# EAGLE design basic_board (EAGLE 7.2.0)
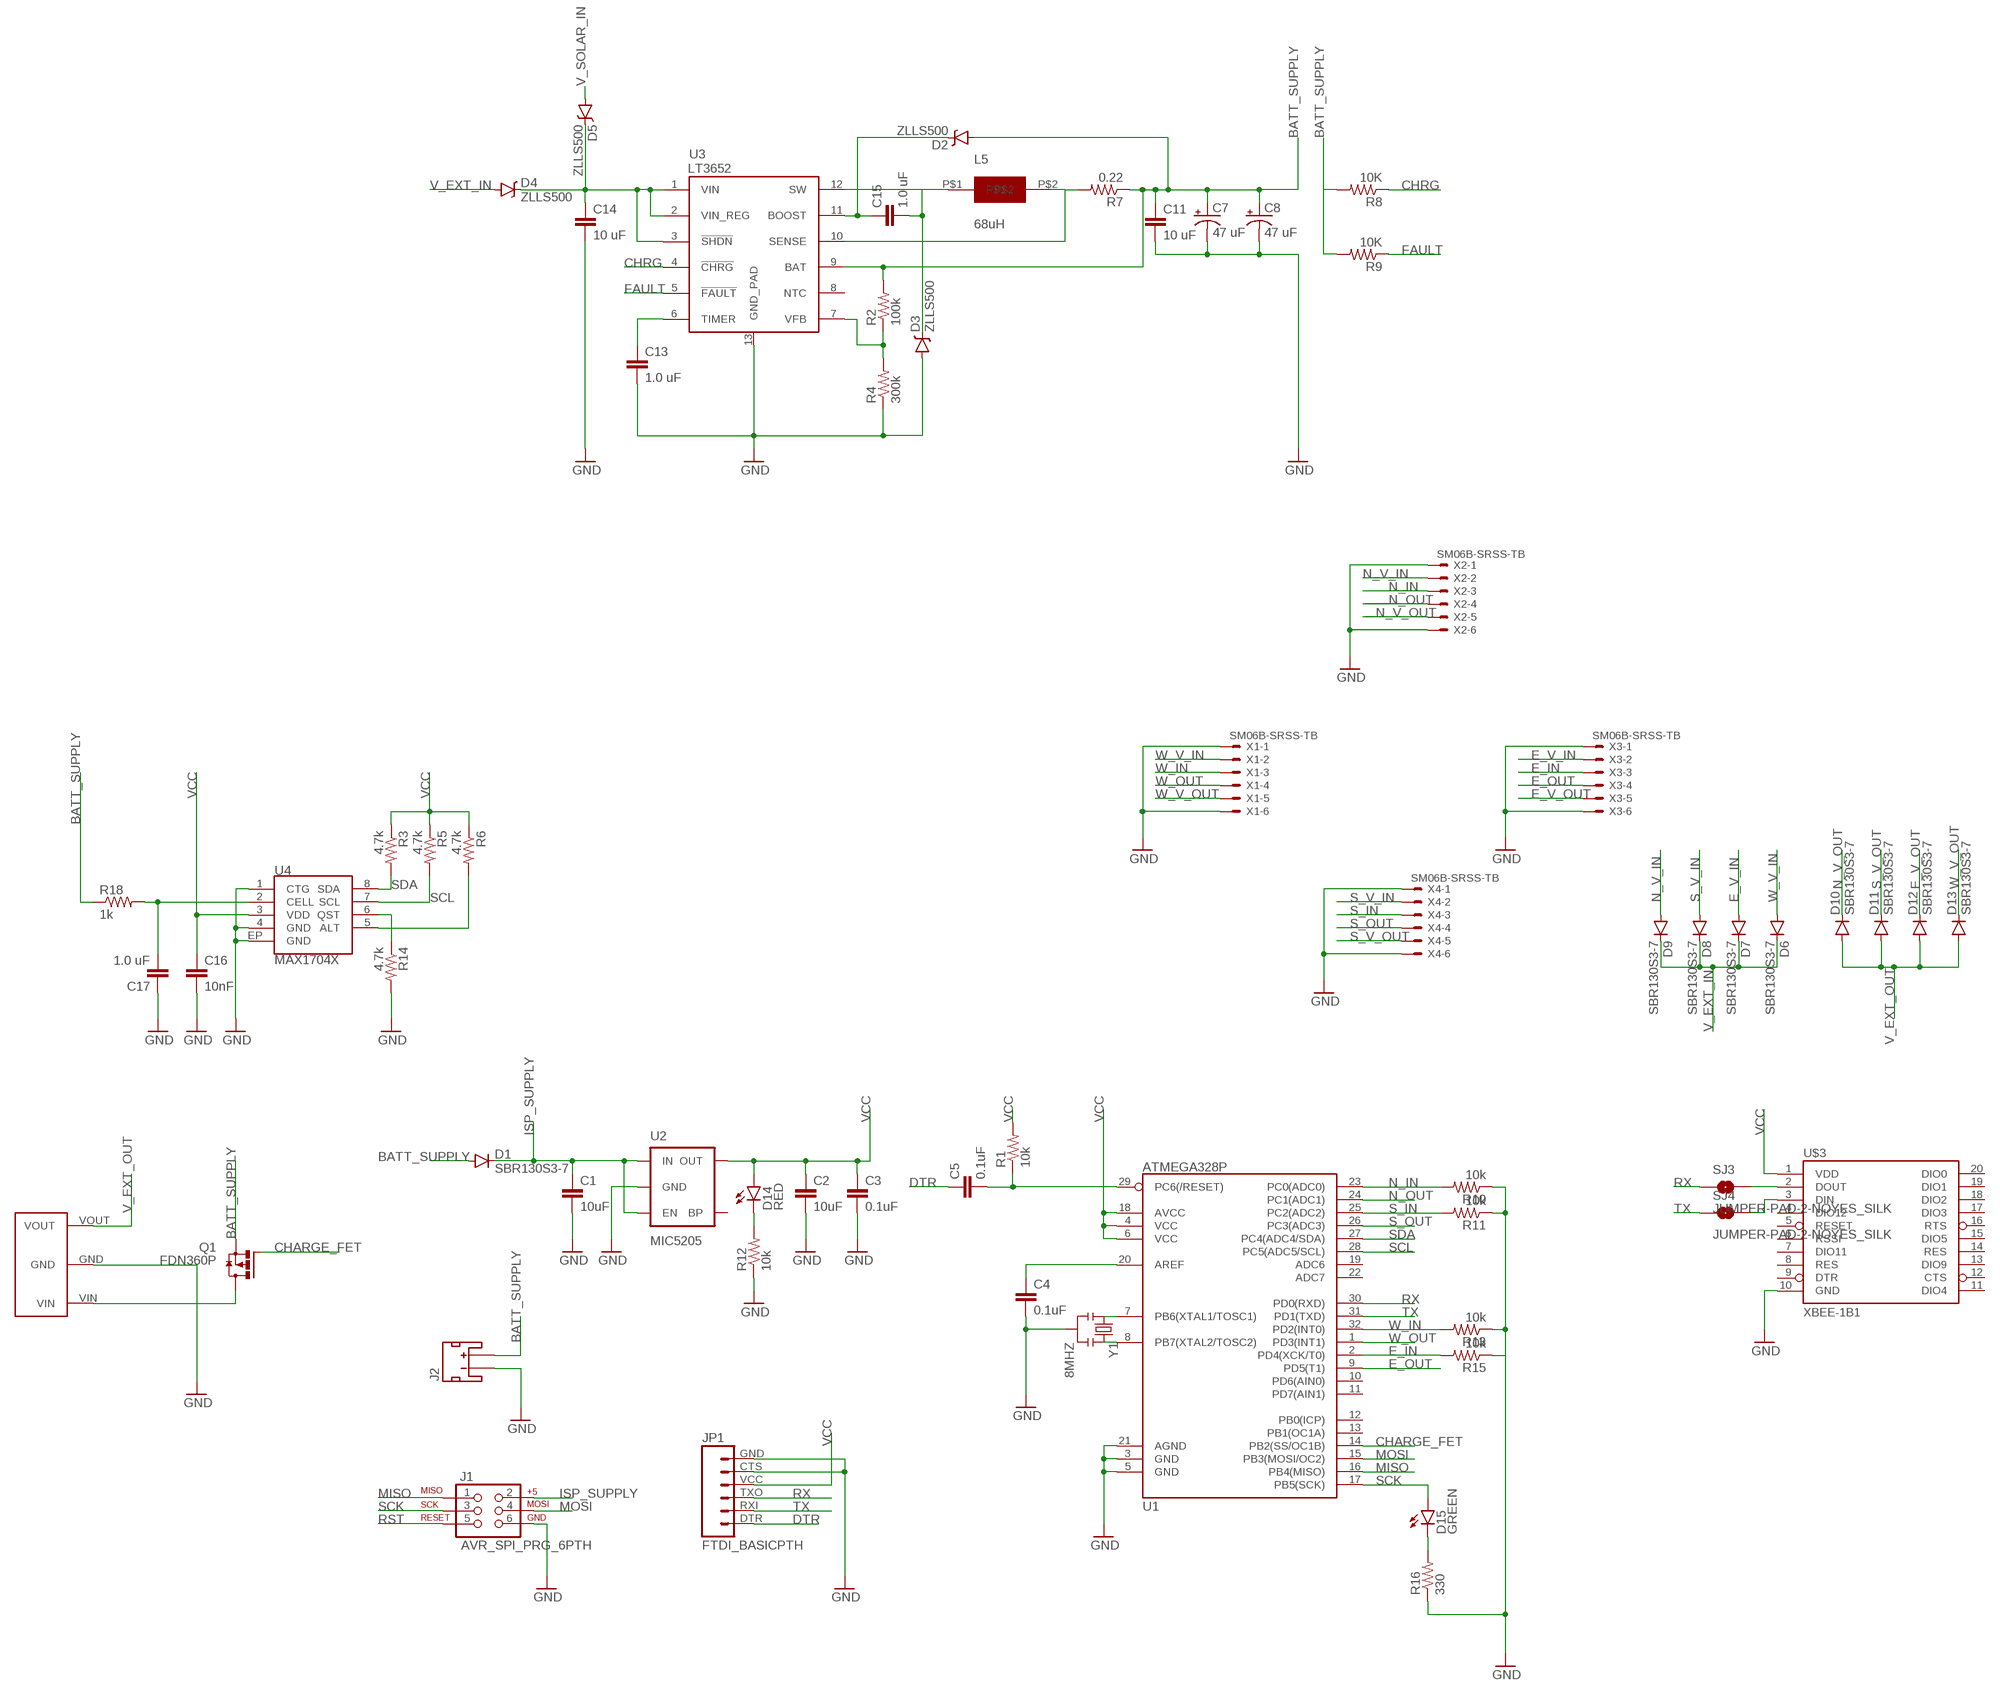
[diagram p0: schematic, sheet 1]

## Parts
C1  10uF  CAP1206  [1206]
C2  10uF  CAP1206  [1206]
C3  0.1uF  CAP1206  [1206]
C4  0.1uF  CAP0603-CAP  [0603-CAP]
C5  0.1uF  CAP0603-CAP  [0603-CAP]
C7  47 uF  CAP_POL1206  [EIA3216]
C8  47 uF  CAP_POL1206  [EIA3216]
C11  10 uF  10UF-6.3V-20%(1206)  [1206]
C13  1.0 uF  10UF-6.3V-20%(1206)  [1206]
C14  10 uF  10UF-6.3V-20%(1206)  [1206]
C15  1.0 uF  10UF-6.3V-20%(1206)  [1206]
C16  10nF  CAP0603-CAP  [0603-CAP]
C17  1.0 uF  CAP0603-CAP  [0603-CAP]
D1  SBR130S3-7  DIODESOD  [SOD-323]
D2  ZLLS500  ZLLS500ZLLS500  [SOT23]
D3  ZLLS500  ZLLS500ZLLS500  [SOT23]
D4  ZLLS500  ZLLS500ZLLS500  [SOT23]
D5  ZLLS500  ZLLS500ZLLS500  [SOT23]
D6  SBR130S3-7  DIODESOD  [SOD-323]
D7  SBR130S3-7  DIODESOD  [SOD-323]
D8  SBR130S3-7  DIODESOD  [SOD-323]
D9  SBR130S3-7  DIODESOD  [SOD-323]
D10  SBR130S3-7  DIODESOD  [SOD-323]
D11  SBR130S3-7  DIODESOD  [SOD-323]
D12  SBR130S3-7  DIODESOD  [SOD-323]
D13  SBR130S3-7  DIODESOD  [SOD-323]
D14  RED  LED-RED0603  [LED-0603]
D15  GREEN  LED-GREEN0603  [LED-0603]
J1  AVR_SPI_PRG_6PTH  [2X3]
J2  JST_2MM_MALE  [JST-2-SMD]
JP1  FTDI_BASICPTH  [FTDI_BASIC]
L5  68uH  MURATA_29L683CSMD1  [MURATA_29L68C]
Q1  FDN360P  [SUPER-SOT3]
R1  10k  RESISTOR0603-RES  [0603-RES]
R2  100k  RESISTOR1206  [1206]
R3  4.7k  RESISTOR0603-RES  [0603-RES]
R4  300k  RESISTOR1206  [1206]
R5  4.7k  RESISTOR0603-RES  [0603-RES]
R6  4.7k  RESISTOR0603-RES  [0603-RES]
R7  0.22  RESISTOR1206  [1206]
R8  10K  RESISTOR1206  [1206]
R9  10K  RESISTOR1206  [1206]
R10  10k  RESISTOR0603-RES  [0603-RES]
R11  10k  RESISTOR0603-RES  [0603-RES]
R12  10k  RESISTOR1206  [1206]
R13  10k  RESISTOR0603-RES  [0603-RES]
R14  4.7k  RESISTOR0603-RES  [0603-RES]
R15  10k  RESISTOR0603-RES  [0603-RES]
R16  330  RESISTOR1206  [1206]
R18  1k  RESISTOR0603-RES  [0603-RES]
SJ3  JUMPER-PAD-2-NOYES_SILK  [PAD-JUMPER-2-NO_YES_SILK]
SJ4  JUMPER-PAD-2-NOYES_SILK  [PAD-JUMPER-2-NO_YES_SILK]
U1  ATMEGA328P  ATMEGA328_SMT  [TQFP32-08]
U2  MIC5205  MIC52053.3V  [SOT23-5]
U3  LT3652  [MSOP-12_GND]
U4  MAX1704X  [TDFN-8]
U$1  POLOLU791BOOSTPOLOLU  [POLOLU791_BOOST]
U$3  XBEE-1B1  [XBEE-1]
X1  SM06B-SRSS-TB  [SM06B-SRSS-TB]
X2  SM06B-SRSS-TB  [SM06B-SRSS-TB]
X3  SM06B-SRSS-TB  [SM06B-SRSS-TB]
X4  SM06B-SRSS-TB  [SM06B-SRSS-TB]
Y1  8MHZ  RESONATOR8MHZ  [RESONATOR-SMD]

## Nets
BATT_SUPPLY: C7.A(+) C8.A(+) C11.1 D1.A D2.1(A) J2.2(+) Q1.2(S) R2.2 R7.1 R8.2 R9.2 R18.1 U3.9(BAT)
CHARGE_FET: Q1.1(G) U1.14(PB2(SS/OC1B))
CHRG: R8.1 U3.4(!CHRG)
DTR: C5.1 JP1.DTR
E_IN: R15.2 U1.2(PD4(XCK/T0)) X3.3
E_OUT: U1.9(PD5(T1)) X3.4
E_V_IN: D7.A X3.2
E_V_OUT: D12.C X3.5
FAULT: R9.1 U3.5(!FAULT)
GND: C1.2 C2.2 C3.2 C4.2 C7.C(-) C8.C(-) C11.2 C13.2 C14.2 C16.2 C17.1 D3.1(A) J1.6 J2.1(-) JP1.CTS JP1.GND R4.1 R10.1 R11.1 R12.1 R13.1 R14.2 R15.1 R16.1 U1.3(GND) U1.5(GND) U1.21(AGND) U2.2(GND) U3.13(GND_PAD) U4.1(CTG) U4.4(GND) U4.EP(GND) U$1.GND U$3.10(GND) X1.1 X1.6 X2.1 X2.6 X3.1 X3.6 X4.1 X4.6 Y1.2
ISP_SUPPLY: C1.1 D1.C J1.2 U2.1(IN) U2.3(EN)
MISO: J1.1 U1.16(PB4(MISO))
MOSI: J1.4 U1.15(PB3(MOSI/OC2))
N$1: C13.1 U3.6(TIMER)
N$2: L5.P$2 R7.2 U3.10(SENSE)
N$4: C4.1 U1.20(AREF)
N$6: R6.2 U4.5(ALT)
N$8: R2.1 R4.2 U3.7(VFB)
N$10: C15.1 D2.3(C) U3.11(BOOST)
N$11: C15.2 D3.3(C) L5.P$1 U3.12(SW)
N$14: R14.1 U4.6(QST)
N$19: Q1.3(D) U$1.VIN
N$20: U1.7(PB6(XTAL1/TOSC1)) Y1.1
N$21: U1.8(PB7(XTAL2/TOSC2)) Y1.3
N$22: C17.2 R18.2 U4.2(CELL)
N$23: SJ3.2 U$3.2(DOUT)
N$24: SJ4.2 U$3.3(DIN)
N$28: D14.C R12.2
N$30: D15.C R16.2
N$31: C14.1 D4.3(C) D5.3(C) U3.1(VIN) U3.2(VIN_REG) U3.3(!SHDN)
N_IN: R10.2 U1.23(PC0(ADC0)) X2.3
N_OUT: U1.24(PC1(ADC1)) X2.4
N_V_IN: D9.A X2.2
N_V_OUT: D10.C X2.5
RST: C5.2 J1.5 R1.1 U1.29(PC6(/RESET))
RX: JP1.TXO SJ3.1 U1.30(PD0(RXD))
S_IN: R11.2 U1.25(PC2(ADC2)) X4.3
S_OUT: U1.26(PC3(ADC3)) X4.4
S_V_IN: D8.A X4.2
S_V_OUT: D11.C X4.5
SCK: D15.A J1.3 U1.17(PB5(SCK))
SCL: R5.2 U1.28(PC5(ADC5/SCL)) U4.7(SCL)
SDA: R3.2 U1.27(PC4(ADC4/SDA)) U4.8(SDA)
TX: JP1.RXI SJ4.1 U1.31(PD1(TXD))
V_EXT_IN: D4.1(A) D6.C D7.C D8.C D9.C
V_EXT_OUT: D10.A D11.A D12.A D13.A U$1.VOUT
V_SOLAR_IN: D5.1(A)
VCC: C2.1 C3.1 C16.1 D14.A JP1.VCC R1.2 R3.1 R5.1 R6.1 U1.4(VCC) U1.6(VCC) U1.18(AVCC) U2.5(OUT) U4.3(VDD) U$3.1(VDD)
W_IN: R13.2 U1.32(PD2(INT0)) X1.3
W_OUT: U1.1(PD3(INT1)) X1.4
W_V_IN: D6.A X1.2
W_V_OUT: D13.C X1.5
Unconnected: J2.NC1(PAD1) J2.NC2(PAD2) U1.10(PD6(AIN0)) U1.11(PD7(AIN1)) U1.12(PB0(ICP)) U1.13(PB1(OC1A)) U1.19(ADC6) U1.22(ADC7) U2.4(BP) U3.8(NTC) U$3.4(DIO12) U$3.5(RESET) U$3.6(RSSI) U$3.7(DIO11) U$3.8(RES) U$3.9(DTR) U$3.11(DIO4) U$3.12(CTS) U$3.13(DIO9) U$3.14(RES) U$3.15(DIO5) U$3.16(RTS) U$3.17(DIO3) U$3.18(DIO2) U$3.19(DIO1) U$3.20(DIO0)

## Library data of the parts
C1-C3 = SparkFun-Capacitors:CAP: Capacitor Standard 0603 ceramic capacitor, and 0.1" leaded capacitor.
C4 C5 C16 C17 = SparkFun-Passives:CAP: Capacitor Standard 0603 ceramic capacitor, and 0.1" leaded capacitor.
C7 C8 = SparkFun-Capacitors:CAP_POL: Capacitor Polarized These are standard SMD and PTH capacitors. Normally 10uF, 47uF, and 100uF in electrolytic and tantalum varieties. Always verify the external diameter of the through hole cap, it varies with capacity, voltage, and manufacturer. The EIA devices should be standard.
C11 C13-C15 = SparkFun-Capacitors:10UF-6.3V-20%(1206): CAP-10057 Ceramic; PROD_ID: CAP-10057; VALUE: 10uF
D1 D6-D13 = SparkFun-DiscreteSemi:DIODE: Diode These are standard reverse protection diodes and small signal diodes. SMA package can handle up to about 1A. SOD-323 can handle about 200mA. What the SOD-323 package when ordering, there are some mfgs out there that are 5-pin packages.; PROD_ID: DIO-09646
D2-D5 = SparkFun-DiscreteSemi:ZLLS500: 700mA 40V SOT-23 Schottky; PROD_ID: DIO-08411
D14 = SparkFun-LED:LED-RED: Assorted Red LEDs LilyPad 1206- DIO-09912 1206- DIO-00809 0603- DIO-00819; PROD_ID: DIO-00819
D15 = SparkFun-LED:LED-GREEN: Various green LEDs Green LEDs used in SFE Production 0603- DIO-00821 LARGE- DIO-00862 LILYPAD- DIO-09910; PROD_ID: DIO-00821
J1 = SparkFun-Connectors:AVR_SPI_PRG_6: AVR ISP 6 Pin This is the reduced ISP connector for AVR programming. Common on Arduino. This footprint will take up less PCB space and can be used with a 10-pin to 6-pin adapter such as SKU: BOB-08508 **Special note about "TEST_POINT" package. The stop mask is on the top side, so if you want your programming test points to be on the bottom of your board, make sure to place this package on the bottom side of the board. This also ensure that the orientation to program from the bottom side will be correct.
J2 = SparkFun-Connectors:JST_2MM_MALE: Mates to single-cell LiPo batteries. CONN-08352; PROD_ID: CONN-08352
JP1 = SparkFun-Connectors:FTDI_BASIC: FTDI Basic header with labels
L5 = Local_RUBICS:MURATA_29L683C
Q1 = transistor-power:FDN360P: Single P-Channel, PowerTrench (R) MOSFET Source: http://www.fairchildsemi.com/ds/FD/FDN360P.pdf
R1 R3 R5 R6 R10 R11 R13-R15 R18 = SparkFun-Passives:RESISTOR: Resistor Basic schematic elements and footprints for 0603, 1206, and PTH resistors.
R2 R4 R7-R9 R12 R16 = SparkFun-Resistors:RESISTOR: Resistor Basic schematic elements and footprints for 0603, 1206, and PTH resistors.
SJ3 SJ4 = SparkFun-Passives:JUMPER-PAD-2-NO
U1 = SparkFun-DigitalIC:ATMEGA328_SMT: 32-Pin Atmega328 part Commonly used on Arduino compatible boards Available in QFP and QFN packages TQFP is IC-09069 QFN is non-stock; PROD_ID: IC-09069
U2 = SparkFun-PowerIC:MIC5205: MIC5205 150mA vreg 3.3V - VREG-00822 5V - VREG-00823; PROD_ID: VREG-00822
U3 = SparkFun-PowerIC:LT3652: LT3652 MPPT Solar Charge Controller 5V-32V smart charger for batteries up to 14.4V
U4 = SparkFun-PowerIC:MAX1704X: MAX17043/MAX17044: Battery Fuel Guage (43 is 1cell, 44 is 2cell)
U$1 = Local_RUBICS:POLOLU791BOOST
U$3 = SparkFun-RF:XBEE-1: Xbee module footprints SMT header is CONN-09042.
X1-X4 = con-jst2:?M06B-SRSS-TB: Disconnectable Crimp style connector, 1.0mm pitch 6 contacts
Y1 = SparkFun-FreqCtrl:RESONATOR: Resonator Small SMD resonator. Used, eg, on the Arduino Pro/ Pro Mini boards. 8MHz- XTAL-08895 16MHz- XTAL-08900; PROD_ID: XTAL-08895

## Board
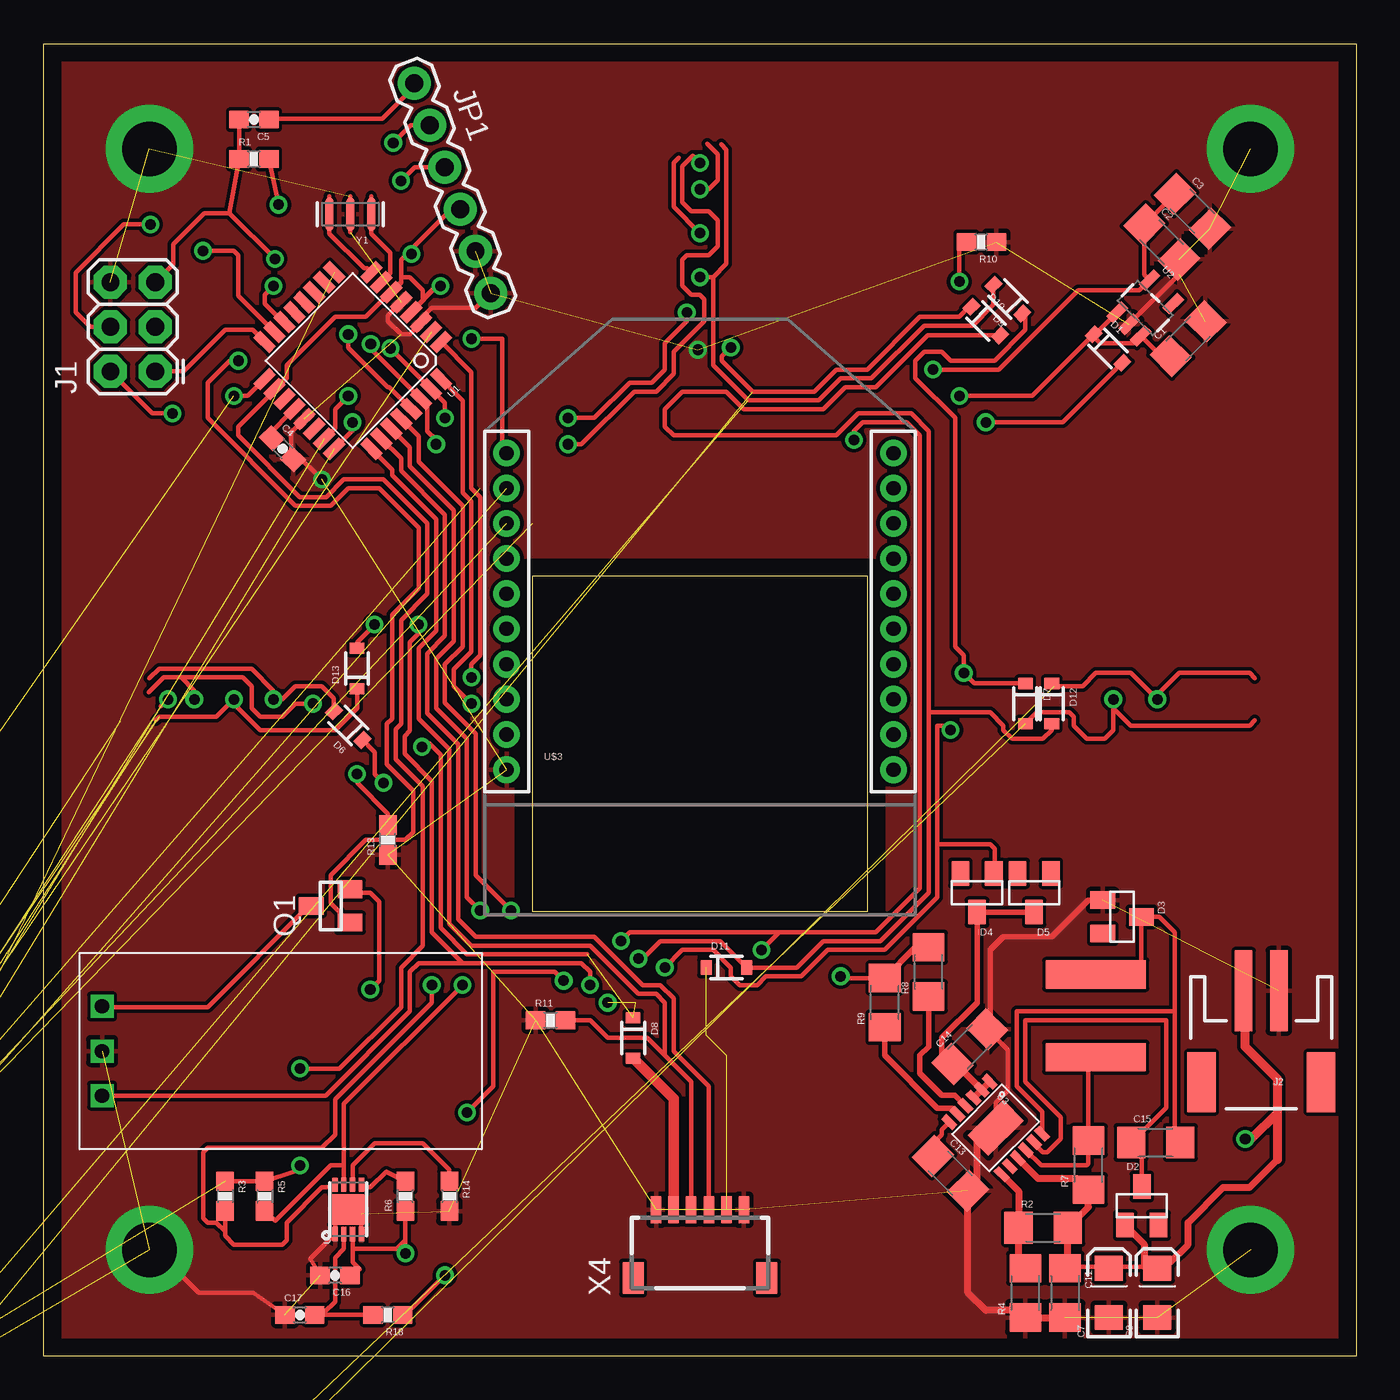
[diagram p1: board, top side]
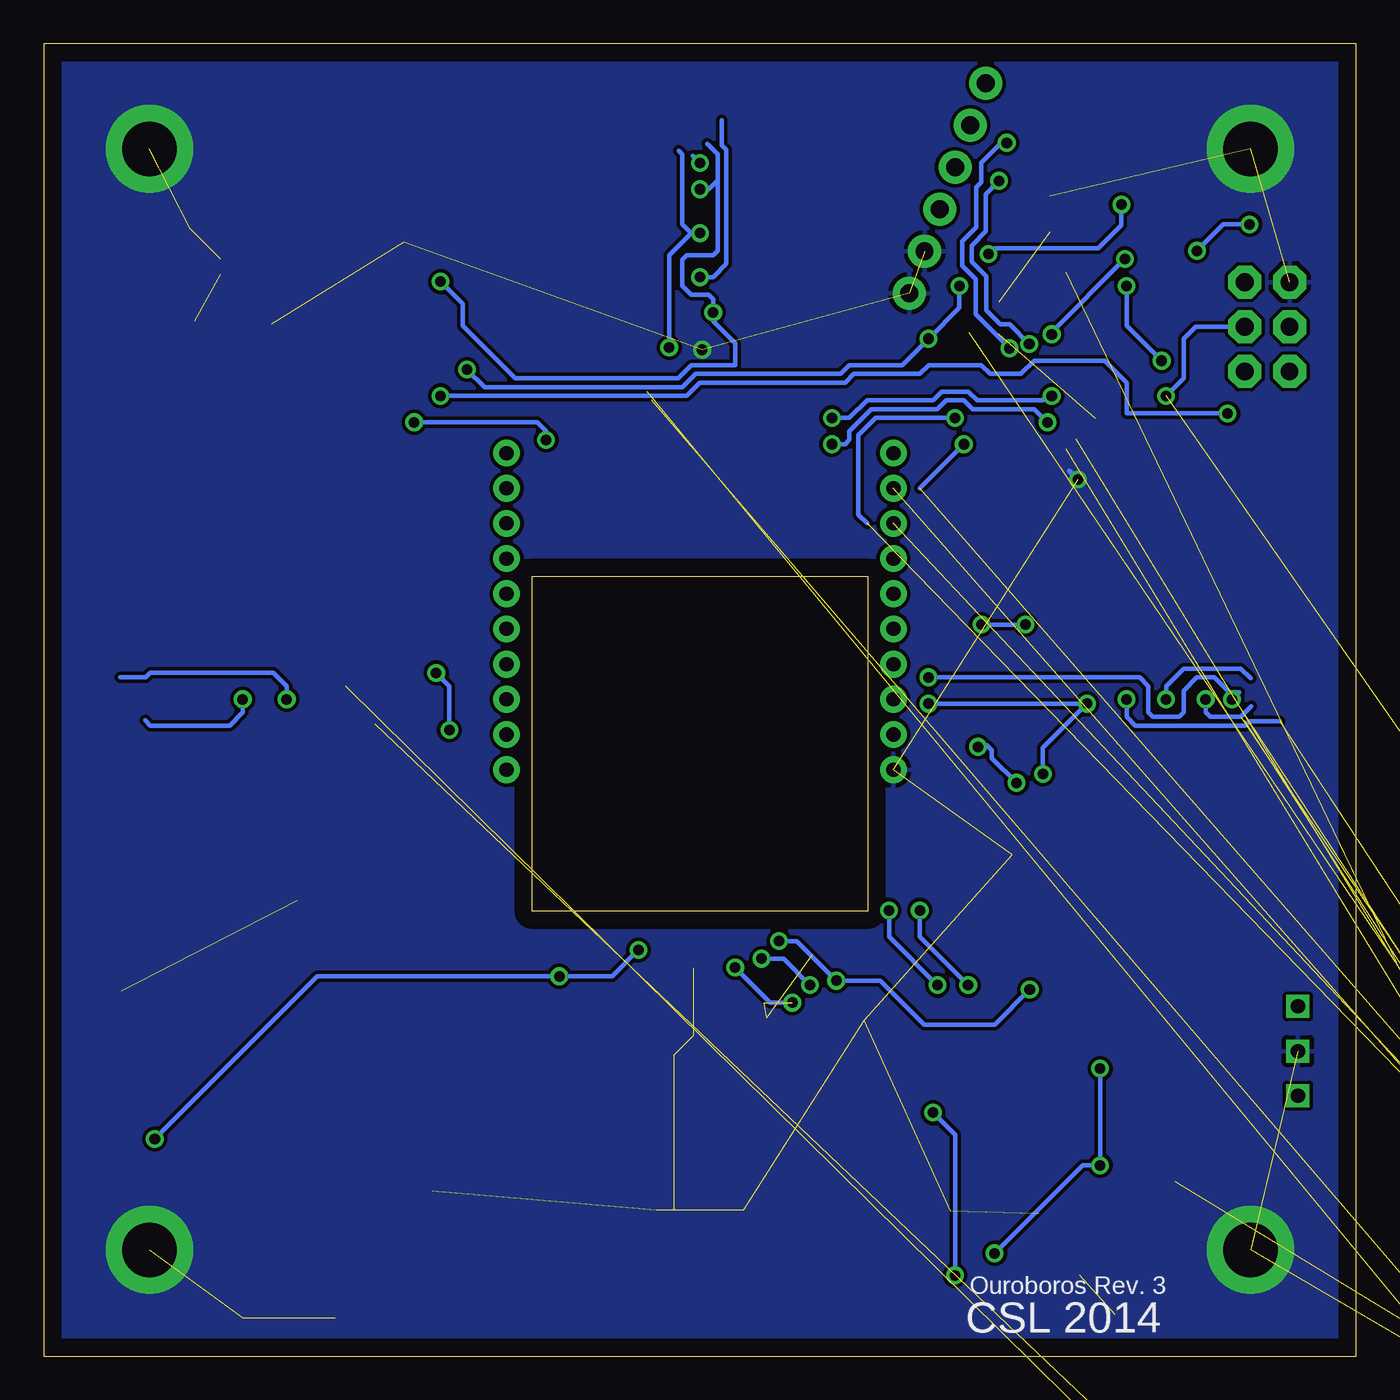
[diagram p2: board, bottom side, seen from below]

Size 74.6 x 74.6 mm. Coordinates in mm from the lower left corner, seen from the top.
Outline: 27.78,25.27 46.82,25.27 46.82,44.33 27.78,44.33 27.78,25.27
Outline: 0,74.6 74.6,74.6 74.6,0 0,0 0,74.6
Copper layers (1*16): Top 0.035mm / dielectric 1.5mm / Bottom 0.035mm
Design rules "default *": minimum track width 8mil, minimum drill 24mil, track to track 8mil, track to pad 8mil, pad to pad 8mil, via to via 8mil, smd to smd 8mil, copper to edge 40mil, drill to drill 8mil, minimum pad ring 10mil, minimum via ring 8mil, stop-mask expansion 4mil, vias tented up to drill 25mil, thermal gap 10mil
tRestrict: area 27.8,25.1 to 46.8,44.3
bRestrict: area 27.8,25.1 to 46.8,44.3

### Footprints (pad centres in the part's own frame; a part is rotated, then mirrored left to right if it is on the bottom)
1206 = smd 1.6 x 1.8: 1 -1.4,0; 2 1.4,0
0603-CAP = smd 1.1 x 1: 1 -0.85,0; 2 0.85,0
EIA3216 = smd 1.4 x 1.6: A 1.4,0; C -1.4,0
SOD-323 = smd 0.63 x 0.83: A 1.15,0; C -1.15,0
SOT23 = smd 1 x 1.4: 1 -0.95,-1.1; 2 0.95,-1.1; 3 0,1.1
LED-0603 = smd 1 x 1: A 0,-0.877; C 0,0.877
2X3 = drill 1.016 pad 1.88 octagon: 1 0,0; 2 0,2.54; 3 2.54,0; 4 2.54,2.54; 5 5.08,0; 6 5.08,2.54
JST-2-SMD = smd 1 x 4.6: 1 -1,-3.7; 2 1,-3.7 | smd 1.6 x 3.4: NC1 -3.4,1.5; NC2 3.4,1.5
FTDI_BASIC = drill 1.016 pad 1.88: CTS 10.16,0; DTR 0,0; GND 12.7,0; RXI 2.54,0; TXO 5.08,0; VCC 7.62,0
MURATA_29L68C = smd 1.6 x 5.7: P$1 -2.35,0; P$2 2.35,0
SUPER-SOT3 = smd 1 x 1.4: 1 -0.95,-1.1; 2 0.95,-1.1; 3 0,1.1
0603-RES = smd 1.1 x 1: 1 -0.85,0; 2 0.85,0
PAD-JUMPER-2-NO_YES_SILK = smd 0.635 x 1.27: 1 -0.45,0; 2 0.45,0
TQFP32-08 = smd 1.27 x 0.559: 1 -4.293,2.8; 2 -4.293,2; 3 -4.293,1.2; 4 -4.293,0.4; 5 -4.293,-0.4; 6 -4.293,-1.2; 7 -4.293,-2; 8 -4.293,-2.8; 17 4.293,-2.8; 18 4.293,-2; 19 4.293,-1.2; 20 4.293,-0.4; 21 4.293,0.4; 22 4.293,1.2; 23 4.293,2; 24 4.293,2.8 | smd 0.559 x 1.27: 9 -2.8,-4.293; 10 -2,-4.293; 11 -1.2,-4.293; 12 -0.4,-4.293; 13 0.4,-4.293; 14 1.2,-4.293; 15 2,-4.293; 16 2.8,-4.293; 25 2.8,4.293; 26 2,4.293; 27 1.2,4.293; 28 0.4,4.293; 29 -0.4,4.293; 30 -1.2,4.293; 31 -2,4.293; 32 -2.8,4.293
SOT23-5 = smd 0.55 x 1.2: 1 -0.95,-1.3; 2 0,-1.3; 3 0.95,-1.3; 4 0.95,1.3; 5 -0.95,1.3
MSOP-12_GND = smd 0.889 x 0.42: 1 -2.1,1.625; 2 -2.1,0.975; 3 -2.1,0.325; 4 -2.1,-0.325; 5 -2.1,-0.975; 6 -2.1,-1.625; 7 2.1,-1.625; 8 2.1,-0.975; 9 2.1,-0.325; 10 2.1,0.325; 11 2.1,0.975; 12 2.1,1.625 | smd 1.651 x 2.845: 13 0,0
TDFN-8 = smd 0.8 x 0.3: 1 -1.4,0.75; 2 -1.4,0.25; 3 -1.4,-0.25; 4 -1.4,-0.75; 5 1.4,-0.75; 6 1.4,-0.25; 7 1.4,0.25; 8 1.4,0.75 | smd 1.73 x 1.88: EP 0,0
POLOLU791_BOOST = drill 0.8 square: GND 0,0; VIN 2.54,0; VOUT -2.54,0
XBEE-1 = drill 0.8 pad 1.524: 1 -11,20; 2 -11,18; 3 -11,16; 4 -11,14; 5 -11,12; 6 -11,10; 7 -11,8; 8 -11,6; 9 -11,4; 10 -11,2; 11 11,2; 12 11,4; 13 11,6; 14 11,8; 15 11,10; 16 11,12; 17 11,14; 18 11,16; 19 11,18; 20 11,20
SM06B-SRSS-TB = smd 0.6 x 1.55: 1 -2.5,2.975; 2 -1.5,2.975; 3 -0.5,2.975; 4 0.5,2.975; 5 1.5,2.975; 6 2.5,2.975 | smd 1.2 x 1.8: FIT@1 -3.8,-0.9; FIT@2 3.8,-0.9
RESONATOR-SMD = smd 0.45 x 1.905: 1 -1.2,0; 2 0,0; 3 1.2,0

### Placement (x,y rotation side)
C1  65.05,57.84 45 top
C2  63.55,63.34 315 top
C3  65.3,65.09 315 top
C4  13.56,51.59 315 top
C5  11.94,70.3 180 top
C7  60.55,3.59 90 top
C8  63.3,3.59 90 top
C11  58.05,3.59 270 top
C13  51.54,10.39 315 top
C14  52.64,17.59 45 top
C15  63.21,12.14 0 top
C16  16.55,4.59 180 top
C17  14.55,2.34 0 top
D1  60.5,57.28 315 top
D2  62.42,8.54 0 top
D3  61.3,24.97 270 top
D4  53.05,26.34 180 top
D5  56.3,26.34 180 top
D6  17.3,35.84 135 top
D7  55.8,37.09 270 top
D8  33.5,18.09 270 top
D9  54.8,60.09 135 top
D10  53.55,58.84 315 top
D11  38.8,22.09 0 top
D12  57.3,37.09 270 top
D13  17.8,39.09 90 top
D14  -37.9,-18.56 0 top  (outside the outline)
D15  -40.8,-18.56 0 top  (outside the outline)
J1  6.32,55.98 90 top
J2  69.21,17.07 180 top
JP1  21.06,72.37 290 top
L5  59.8,19.34 270 top
Q1  16.3,25.59 90 top
R1  11.94,68.06 0 top
R2  56.81,7.29 0 top
R3  10.3,9.09 270 top
R4  55.8,3.59 90 top
R5  12.55,9.09 270 top
R6  20.55,9.09 90 top
R7  59.39,10.85 90 top
R8  50.3,21.84 90 top
R9  47.8,20.09 90 top
R10  53.3,63.34 180 top
R11  28.8,19.09 0 top
R12  -33.7,-18.06 0 top  (outside the outline)
R13  19.55,29.34 90 top
R14  23.05,9.09 270 top
R15  -27.9,-14.26 0 top  (outside the outline)
R16  -39.5,-21.86 0 top  (outside the outline)
R18  19.55,2.34 180 top
SJ3  -43.5,-29.56 0 top  (outside the outline)
SJ4  -46.4,-29.56 0 top  (outside the outline)
U1  17.56,56.6 225 top
U2  62.61,59.59 315 top
U3  54.11,12.97 315 top
U4  17.3,8.34 90 top
U$1  3.3,17.34 90 top
U$3  37.3,31.34 0 top
X1  -35.2,-29.36 0 top  (outside the outline)
X2  -41,-44.86 0 top  (outside the outline)
X3  -41,-60.36 0 top  (outside the outline)
X4  37.3,5.34 0 top
Y1  17.42,64.92 180 top

### Tracks (layer width: path | path; a pad name or v marks a point on that pad's centre or on a via)
BATT_SUPPLY  (via drill 0.6)
  Top 0.25: R18.1 20.95,2.74 v22.8,4.59 | v24.05,13.84 25.55,15.34 25.55,21.84 29.05,21.84 v29.55,21.34 | v32.8,23.59 33.3,24.09 41.8,24.09 | 41.8,24.09 47.3,24.09 49.8,26.59 49.8,52.34 49.05,53.09 46.55,53.09 46.05,52.59 v46.05,52.09 | 41.8,24.09 v40.8,23.09 | Q1.2 17.6,26.34 18.55,26.34 19.05,25.84 19.05,21.34 v18.55,20.84 | R9.2 45.4,21.49 v45.3,21.59 | v68.3,12.34 68.64,12.34 | v53.55,53.09 57.94,53.09 D1.A | C8.A 62.9,4.99 62.8,5.09 | 62.8,5.09 62.67,5.21 62.55,5.34 62.55,6.34 61.47,7.42 D2.1 | 62.55,5.09 60.65,5.09 C7.A | 62.8,5.09 58.15,5.09 C11.1
  Top 0.3: R9.2 49.55,23.24 R8.2
  Top 0.4: C11.1 58.21,5.15 R2.2 59.39,8.47 R7.1 58.75,10.09 56.53,10.09 U3.9 | D2.1 62.55,6.36 62.55,6.34 62.55,5.09 62.67,5.21 62.8,5.34 64.05,5.34 65.05,6.34 65.05,7.59 67.05,9.59 68.55,9.59 70.14,11.18
  Top 0.5: 70.14,11.18 70.14,13.84 | 70.14,13.84 70.14,15.75 68.3,17.59 68.3,20.68 J2.2 | 68.64,12.34 70.14,13.84
  Bottom 0.25: v22.8,4.59 22.8,12.59 v24.05,13.84 | v40.8,23.09 42.3,21.59 v45.3,21.59 59.05,21.59 v68.3,12.34 | v46.05,52.09 46.05,52.59 46.55,53.09 v53.55,53.09 | v32.8,23.59 31.8,23.59 v29.55,21.34 27.05,21.34 24.55,18.84 20.55,18.84 v18.55,20.84
CHARGE_FET  (via drill 0.6)
  Top 0.25: Q1.1 16.3,25.74 16.3,27.34 18.3,29.34 20.55,29.34 21,29.79 21,32.14 19.5,33.64 19.5,35.94 19.8,36.24 19.8,42.14 21.3,43.64 21.3,47.09 19.05,49.34 17.3,49.34 16.3,48.34 14.3,48.34 9.3,53.34 9.3,55.34 10.55,56.59 v11.05,56.59 | v13.05,60.84 12.55,60.34 12.55,59.84 13.6,58.79 U1.14
  Bottom 0.25: v11.05,56.59 13.05,58.59 v13.05,60.84
CHRG
  Top 0.3: U3.4 51.78,14.84 51.05,14.84 49.8,16.09 49.8,17.09 50.3,17.59 R8.1
DTR
  Top 0.25: JP1.DTR 21.06,72.18 19.22,70.34 13.38,70.34 C5.1
E_IN  (2 unrouted)
E_OUT  (1 unrouted)
E_V_IN  (via drill 0.6)  (1 unrouted)
  Top 0.25: 68.85,36.14 68.55,35.84 61.8,35.84 60.8,36.84 | 60.8,36.84 v60.8,37.34 | 60.8,36.84 60.8,35.59 60.3,35.09 59.3,35.09 58.55,35.84 58.55,36.34 58.3,36.59 56.45,36.59 D7.A
  Bottom 0.25: v60.8,37.34 60.8,38.09 61.55,38.84 68.55,38.84 68.8,38.59 70.25,38.59
E_V_OUT  (via drill 0.6)  (1 unrouted)
  Top 0.25: v63.3,37.34 63.3,37.59 | 63.3,37.59 64.55,38.84 68.55,38.84 68.85,38.54 | 63.3,37.59 63.05,37.59 61.8,38.84 59.8,38.84 59.05,38.09 57.45,38.09 D12.C
  Bottom 0.25: 68.85,36.14 68.55,35.84 64.05,35.84 63.3,36.59 v63.3,37.34
FAULT
  Top 0.3: U3.5 51.61,14.09 50.8,14.09 47.8,17.09 R9.1
GND  (via drill 0.6, 3.1 pad 5)  (34 unrouted)
  Top 0.25: C16.2 15.15,5.54 U4.1 16.55,7.84 17.05,8.34 U4.EP 17.8,8.34 18.05,8.09 U4.4 | C17.1 11.9,3.59 8.8,3.59 6.35,6.04 v6,6.04 | JP1.GND 24.56,59.59 22.05,59.59 21.44,58.98 U1.3 21.44,58.73 20.8,58.09 20.3,58.09 19.55,58.84 19.55,59.16 U1.5 | 53.05,12.34 53.05,12.41 U3.13 54.11,14.4 54.8,15.09 54.8,17.41 C14.2 | 14.3,51.34 14.05,51.59 14.05,52.52 U1.21 | 14.3,51.34 C4.2 | 14.3,51.34 v15.8,49.84 | U2.2 64.54,61.52 C2.2
  Top 0.3: C14.2 53.8,18.75 53.8,23.09 54.55,23.84 57.3,23.84 59.38,25.92 D3.1
  Top 0.4: C11.2 R4.1 55.4,2.59 53.55,2.59 52.53,3.61 C13.2 53.05,9.92 53.05,12.34
  Bottom 0.25: v15.8,49.84 16.3,50.34
  other vias: 68.6,68.64 6,68.64 37.17,57.22 68.6,6.04
  pour Bottom: -8.95,80.84 88.55,80.84 88.55,-7.41 -8.95,-7.41
  pour Top: -5.2,84.09 84.3,84.09 84.3,-12.41 -5.2,-12.41
ISP_SUPPLY  (via drill 0.6)
  Top 0.25: J1.2 6.17,53.59 v7.3,53.59 | D1.C 59.77,58.09 U2.1 | 59.69,57.98 D1.C | D1.C 59.69,57.95 60.05,57.59 61.95,57.59 U2.3 63.51,56.85 C1.1 | v52.05,54.59 56.18,54.59 D1.C
  Bottom 0.25: v7.3,53.59 13.05,53.59 13.05,55.34 14.3,56.59 18.3,56.59 19.05,55.84 20.8,55.84 21.3,56.34 24.3,56.34 24.8,55.84 28.55,55.84 29.05,55.34 37.3,55.34 38.05,54.59 v52.05,54.59
MISO
  Top 0.25: U1.16 11.86,58.34 10.3,58.34 7.94,55.98 J1.1
MOSI  (via drill 0.6)
  Top 0.25: U1.15 11.05,60.28 11.05,62.59 10.8,62.84 v9.05,62.84 | v6.05,64.34 4.55,64.34 1.8,61.59 1.8,59.34 2.62,58.52 J1.4
  Bottom 0.25: v9.05,62.84 7.55,64.34 v6.05,64.34
N$1
  Top 0.25: U3.6 51.05,12.88 51.05,12.59 50.55,12.09 C13.1
N$2
  Top 0.25: L5.P$2 59.39,16.63 R7.2 59.39,10.93 59.3,10.84 56.7,10.84 U3.10
N$4
  Top 0.25: U1.20 12.72,52.33 C4.1
N$6
  Top 0.25: U4.5 18.2,9.59 18.55,9.59 19.45,10.49 R6.2
N$8
  Top 0.4: U3.7 55.41,9.37 R2.1 55.41,5.38 R4.2
N$10
  Top 0.25: U3.11 56.29,12.1 56.8,11.59 57.05,11.59 57.8,12.34 57.8,13.59 55.8,15.59 55.8,19.09 63.8,19.09 63.8,14.13 C15.1 62.42,11.53 D2.3
N$11
  Top 0.25: 64.3,19.59 64.3,24.09 63.42,24.97 D3.3 62.4,21.94 62.3,21.84 60,21.84 L5.P$1 | 64.3,19.59 64.3,12.45 C15.2 | U3.12 56.74,13.89 55.3,15.34 55.3,19.59 64.3,19.59
N$12  (via drill 0.6)
  other vias: 63.3,37.34
N$13  (via drill 0.6)
  other vias: 60.8,37.34
N$14
  Top 0.25: U4.6 17.55,10.84 18.8,12.09 21.55,12.09 23.05,10.59 R14.1
N$15  (via drill 0.6)
  other vias: 10.8,37.34
N$16  (via drill 0.6)
  other vias: 13.05,37.34
N$17  (via drill 0.6)
  other vias: 37.3,63.84
N$18  (via drill 0.6)
  other vias: 37.3,61.34
N$19
  Top 0.25: U$1.VIN 3.34,19.84 9.3,19.84 15.05,25.59 Q1.3
N$20
  Top 0.25: U1.7 19.7,61.57 19.7,62.74 18.62,63.82 18.62,63.91
N$21
  Top 0.25: U1.8 18.39,61.84 18.2,61.84 16.22,63.82 16.22,63.91
N$22
  Top 0.25: U4.2 17.05,6.09 16.55,5.59 16.55,3.09 15.95,2.49 C17.2 R18.2
N$23  (1 unrouted)
N$24  (1 unrouted)
N$28  (1 unrouted)
N$30  (1 unrouted)
N$31
  Top 0.3: C14.1 51.05,17.2 51.05,18.09 53.05,20.09 D4.3 D5.3
  Top 0.4: U3.1 U3.2 | U3.2 51.86,16.6 C14.1 | U3.3 U3.2
N_IN  (via drill 0.6)  (1 unrouted)
  Top 0.25: 37.7,68.94 38.3,68.34 38.3,66.84 37.8,66.34 v37.3,66.34 | U1.23 16.55,52.76 16.55,53.84 v17.3,54.59 | v29.8,53.34 31.3,53.34 33.3,55.34 34.55,55.34 35.3,56.09 35.3,57.59 36.55,58.84 v36.55,59.34 | v52.05,61.09 52.05,63.19 R10.2
  Bottom 0.25: v37.3,66.34 36.8,66.34 36.3,66.84 | 36.3,66.84 36.3,68.34 36.9,68.94 | 36.3,66.84 36.3,62.84 36.55,62.59 38.05,62.59 38.3,62.34 38.3,60.84 37.8,60.34 36.8,60.34 36.55,60.09 v36.55,59.34 36.55,58.84 35.3,57.59 35.3,56.34 37.8,56.34 38.55,55.59 47.8,55.59 50.8,58.59 50.8,59.84 v52.05,61.09 | v29.8,53.34 28.8,53.34 27.8,54.34 24.05,54.34 23.55,54.84 22.05,54.84 21.55,54.34 17.8,54.34 17.55,54.59 v17.3,54.59
N_OUT  (via drill 0.6)  (1 unrouted)
  Top 0.25: v37.3,67.84 36.9,68.24 36.3,67.64 36.3,65.59 36.8,65.09 37.8,65.09 38.3,64.59 38.3,63.09 37.8,62.59 36.55,62.59 36.3,62.34 36.3,60.84 36.8,60.34 37.3,60.34 37.55,60.09 37.55,58.84 35.8,57.09 35.8,55.84 34.8,54.84 33.55,54.84 30.55,51.84 v29.8,51.84 | U1.24 17.55,52.63 v17.55,53.09
  Bottom 0.25: 37.7,68.24 v37.3,67.84 | v17.55,53.09 18.3,53.84 21.8,53.84 22.3,54.34 23.3,54.34 23.8,53.84 27.55,53.84 28.8,52.59 28.8,52.09 29.05,51.84 v29.8,51.84
N_V_IN  (via drill 0.6)  (1 unrouted)
  Top 0.25: 38.5,68.89 38.8,68.59 38.8,62.09 38.05,61.34 | 38.05,61.34 v37.3,61.34 | D9.A 53.99,59.78 52.8,58.59 50.05,58.59 47.05,55.59 45.3,55.59 44.05,54.34 40.05,54.34 38.05,56.34 38.05,61.34
  Bottom 0.25: v37.3,61.34 36.55,61.34 35.8,62.09 35.8,68.59 36.05,68.84 36.05,70.25
N_V_OUT  (via drill 0.6)  (1 unrouted)
  Top 0.25: 36.1,68.14 35.8,67.84 35.8,65.34 v37.3,63.84 | v39.05,57.34 38.55,56.84 38.55,56.59 40.3,54.84 43.8,54.84 45.05,56.09 46.8,56.09 49.8,59.09 52.05,59.09 52.61,59.65 D10.C
  Bottom 0.25: v37.3,63.84 37.8,63.84 | 38.5,68.54 38.3,68.34 38.3,64.34 37.8,63.84 | v39.05,57.34 39.05,62.59 37.8,63.84
RST  (via drill 0.6)
  Top 0.25: U1.29 19.64,55.09 19.55,55.09 17.3,57.34 v17.3,58.09 | C5.2 R1.1 10.54,64.98 | v13.14,62.38 10.54,64.98 | J1.5 7.34,62.08 7.34,63.22 9.1,64.98 10.54,64.98
  Bottom 0.25: v17.3,58.09 17.3,58.22 v13.14,62.38
RX  (via drill 0.6)  (1 unrouted)
  Top 0.25: v22.3,51.84 22.3,52.09 21.8,52.59 21.8,54.06 U1.30 18.58,57.28 v18.58,57.54 | v20.3,66.82 21.08,67.6 JP1.TXO
  Bottom 0.25: v22.3,51.84 24.8,49.34 | v18.58,57.54 19.7,58.66 20.22,58.66 21.02,59.46 21.02,61.38 21.86,62.22 21.86,63.14 21.06,63.94 21.06,66.06 v20.3,66.82
S_IN
  Top 0.25: U1.25 19.8,50.4 19.8,50.09 22.3,47.59 22.3,41.24 21.3,40.24 21.3,36.24 23.05,34.49 23.05,24.59 24.3,23.34 31.05,23.34 33.8,20.59 34.8,20.59 35.3,20.09 35.3,17.09 | 35.3,17.09 36.8,15.59 X4.3 | 35.3,17.09 34.3,18.09 32.05,18.09 31.05,19.09 R11.2
S_OUT
  Top 0.25: U1.26 20.3,51.03 20.3,50.34 22.8,47.84 22.8,40.94 21.8,39.94 21.8,36.54 23.55,34.79 23.55,24.84 24.55,23.84 31.3,23.84 34.05,21.09 35.05,21.09 35.8,20.34 35.8,17.34 37.8,15.34 X4.4
S_V_IN
  Top 0.6: X4.2 35.8,14.64 D8.A
S_V_OUT  (3 unrouted)
SCK  (via drill 0.6)  (1 unrouted)
  Top 0.25: U1.17 11.59,54.59 v10.8,54.59
  Bottom 0.25: v10.8,54.59 9.8,55.59 9.8,57.84 9.12,58.52 J1.3
SCL  (via drill 0.6)
  Top 0.25: U4.7 17.05,10.84 | 17.05,10.84 16.3,10.84 13.15,7.69 R5.2 | U1.28 21.3,52.29 21.3,50.84 23.8,48.34 23.8,40.34 22.8,39.34 22.8,37.14 24.55,35.39 24.55,27.34 v26.55,25.34 | v23.8,21.09 17.05,14.34 17.05,10.84
  Bottom 0.25: v26.55,25.34 26.55,23.84 v23.8,21.09
SDA  (via drill 0.6)
  Top 0.25: 16.4,9.59 U4.8 16.55,9.59 16.4,9.59 | 16.4,9.59 15.8,9.59 13.8,7.59 13.8,6.59 13.55,6.34 10.8,6.34 10.3,6.84 10.3,7.09 | 10.3,7.09 R3.2 | 10.3,7.09 9.8,7.59 9.3,7.59 9.05,7.84 9.05,11.59 9.3,11.84 15.8,11.84 16.55,12.59 16.55,14.59 22.05,20.09 v22.05,21.09 | U1.27 20.8,51.66 20.8,50.59 23.3,48.09 23.3,40.64 22.3,39.64 22.3,36.84 24.05,35.09 24.05,26.09 v24.8,25.34
  Bottom 0.25: v24.8,25.34 24.8,23.84 v22.05,21.09
TX  (via drill 0.6)  (1 unrouted)
  Top 0.25: v22.8,53.34 22.8,54.19 U1.31 19.7,57.29 v19.7,57.3 | v19.86,68.98 20.86,69.98 JP1.RXI
  Bottom 0.25: v22.8,53.34 27.3,53.34 28.3,52.34 28.3,47.84 27.8,47.34 | v19.7,57.3 21.62,59.22 21.62,61.22 22.38,61.98 22.38,63.38 21.58,64.18 21.58,66.46 21.3,66.74 21.3,67.86 20.18,68.98 v19.86,68.98
V_EXT_IN  (via drill 0.6)  (3 unrouted)
  Top 0.25: 30.9,22.84 24.05,22.84 22.55,24.34 22.55,34.19 21.9,34.84 21.7,34.84 v21.5,34.64 | 50.8,29.09 50.8,26.09 47.8,23.09 44.55,23.09 43.05,21.59 41.05,21.59 40.55,21.09 39.55,21.09 39.05,21.59 39.05,22.09 38.05,23.09 36.3,23.09 v35.3,22.09 | 50.8,29.09 50.8,35.84 51.3,35.84 v51.55,35.59 | D7.C 52.9,38.24 v52.3,38.84 52.3,39.84 51.8,40.34 51.8,53.34 49.55,55.59 49.55,56.59 50.05,57.09 51.05,57.09 51.55,56.59 54.05,56.59 55.8,58.34 55.8,59.09 D9.C | D4.1 54.05,27.49 54.05,28.84 53.8,29.09 50.8,29.09 | v19.3,32.59 18.8,33.09 18.8,34.34 18.7,34.44 D6.C
  Bottom 0.25: v52.3,38.84 51.55,38.09 v51.55,35.59 | v21.5,34.64 21,34.74 20.7,34.44 20.7,33.99 v19.3,32.59 | v32.05,20.09 33.3,20.09 v35.3,22.09
V_EXT_OUT  (via drill 0.6)
  Top 0.25: 23.8,22.34 21.3,22.34 20.8,21.84 20.8,19.59 16.01,14.8 U$1.VOUT | 23.8,22.34 30.55,22.34 31.05,21.84 v31.05,21.09 | v21.3,41.59 21.3,41.09 20.8,40.59 20.8,35.54 20.5,35.24 20.5,34.24 22.05,32.69 22.05,24.09 23.8,22.34 | v18.8,41.59 17.8,40.59 D13.A | v33.8,22.59 34.05,22.59 35.05,23.59 38.45,23.59 D11.A 42.8,22.09 44.3,23.59 47.55,23.59 50.3,26.34 50.3,36.59 | 50.3,36.59 50.3,52.59 49.3,53.59 46.3,53.59 45.05,52.34 35.8,52.34 35.3,52.84 35.3,53.84 36.3,54.84 38.8,54.84 39.8,53.84 44.3,53.84 45.55,55.09 47.3,55.09 50.24,58.03 D10.A | D12.A 57.3,35.59 56.8,35.09 55.05,35.09 54.55,35.59 54.55,35.84 53.8,36.59 50.3,36.59
  Bottom 0.25: v21.3,41.59 v18.8,41.59 | v31.05,21.09 32.55,22.59 v33.8,22.59
VCC  (via drill 0.6)  (1 unrouted)
  Top 0.25: R3.1 R5.1 14.2,10.49 v14.55,10.84 | 17.55,6.09 17.55,5.34 17.95,4.94 C16.1 | U4.3 17.55,6.09 | 17.55,6.09 20.05,6.09 20.55,6.59 R6.1 v20.55,5.84 | 20.3,61.09 20.3,61.04 U1.6 19.69,60.48 | 20.3,61.34 20.3,62.34 20.62,62.66 | 21.55,60.09 21.55,60.02 U1.4 22.37,60.84 v22.55,60.84 22.3,60.84 21.55,60.09 | 19.69,60.48 18.3,59.09 16.55,59.09 13.8,56.34 13.8,55.67 | 13.8,55.67 U1.18 | 26.05,51.41 26.05,57.84 v24.3,57.84 | 26.05,51.41 U$3.1 26.05,51.34 26.05,51.41 | 21.55,60.09 21.55,60.59 20.8,61.34 20.3,61.34 | 20.3,61.34 20.3,61.09 | 20.3,61.09 19.69,60.48 | 13.8,55.67 13.8,55.59 11.05,52.84 11.05,52.34 14.55,48.84 16.05,48.84 17.05,49.84 19.3,49.84 21.8,47.34 21.8,43.34 20.3,41.84 20.3,35.94 20,35.64 20,33.94 21.55,32.39 21.55,23.34 20.3,22.09 20.3,19.84 16.8,16.34 v14.55,16.34 | 20.62,62.66 23.17,65.21 JP1.VCC | 20.62,62.66 v20.9,62.66 | v13.34,65.46 R1.2 | C3.1 C2.1 62.56,61.48 U2.5 62.27,60.59 58.8,60.59 54.3,56.09 v50.55,56.09
  Bottom 0.25: v20.55,5.84 15.55,10.84 v14.55,10.84 v14.55,16.34 | v22.55,60.84 22.55,59.59 v24.3,57.84 25.8,56.34 28.8,56.34 29.3,55.84 37.55,55.84 38.3,55.09 49.55,55.09 v50.55,56.09 50.3,55.84 | v20.9,62.66 20.58,62.98 14.66,62.98 13.34,64.3 v13.34,65.46
W_IN  (via drill 0.6)  (1 unrouted)
  Top 0.25: 5.95,37.74 6.8,38.59 7.8,38.59 | 7.8,38.59 8.55,37.84 v8.55,37.34 | 7.8,38.59 11.3,38.59 11.8,38.09 11.8,36.84 12.3,36.34 13.55,36.34 14.3,37.09 v15.3,37.09 | U1.32 23.8,54.32 23.8,49.09 24.3,48.59 24.3,40.04 23.3,39.04 23.3,38.09 v24.3,37.09 | v17.8,33.09 17.8,32.59 19.55,30.84 R13.2
  Bottom 0.25: v8.55,37.34 8.55,36.59 8.3,36.34 6.55,36.34 5.95,36.94 | v24.3,37.09 v15.3,37.09 17.8,34.59 v17.8,33.09
W_OUT  (via drill 0.6)  (1 unrouted)
  Top 0.25: v7.05,37.34 6.65,36.94 | U1.1 24.3,55.93 24.3,49.34 24.8,48.84 24.8,39.84 24.3,39.34 v24.3,38.59
  Bottom 0.25: v7.05,37.34 6.65,37.74 7.2,37.74 8.05,38.59 9.05,38.59 9.8,37.84 9.8,36.59 10.05,36.34 11.55,36.34 11.8,36.59 11.8,38.09 12.3,38.59 v24.3,38.59
W_V_IN  (via drill 0.6)  (1 unrouted)
  Top 0.25: 6,38.54 6.55,39.09 11.8,39.09 13.05,37.84 v13.05,37.34 13.55,37.34 14.3,38.09 15.8,38.09 16.49,37.4 D6.A
  Bottom 0.25: v13.05,37.34 13.05,36.34 12.55,35.84 6.3,35.84 6.05,36.09 4.35,36.09
W_V_OUT  (via drill 0.6)  (1 unrouted)
  Top 0.25: 6.35,36.14 6.55,36.34 9.8,36.34 v10.8,37.34 10.8,37.09 12.3,35.59 16.55,35.59 17.8,36.84 D13.C
  Bottom 0.25: 6,38.54 6.55,39.09 9.8,39.09 10.8,38.09 v10.8,37.34

### Text on the board
bNames: Ouroboros Rev. 3 | CSL 2014